# EAGLE design mini (EAGLE 9.6.2)
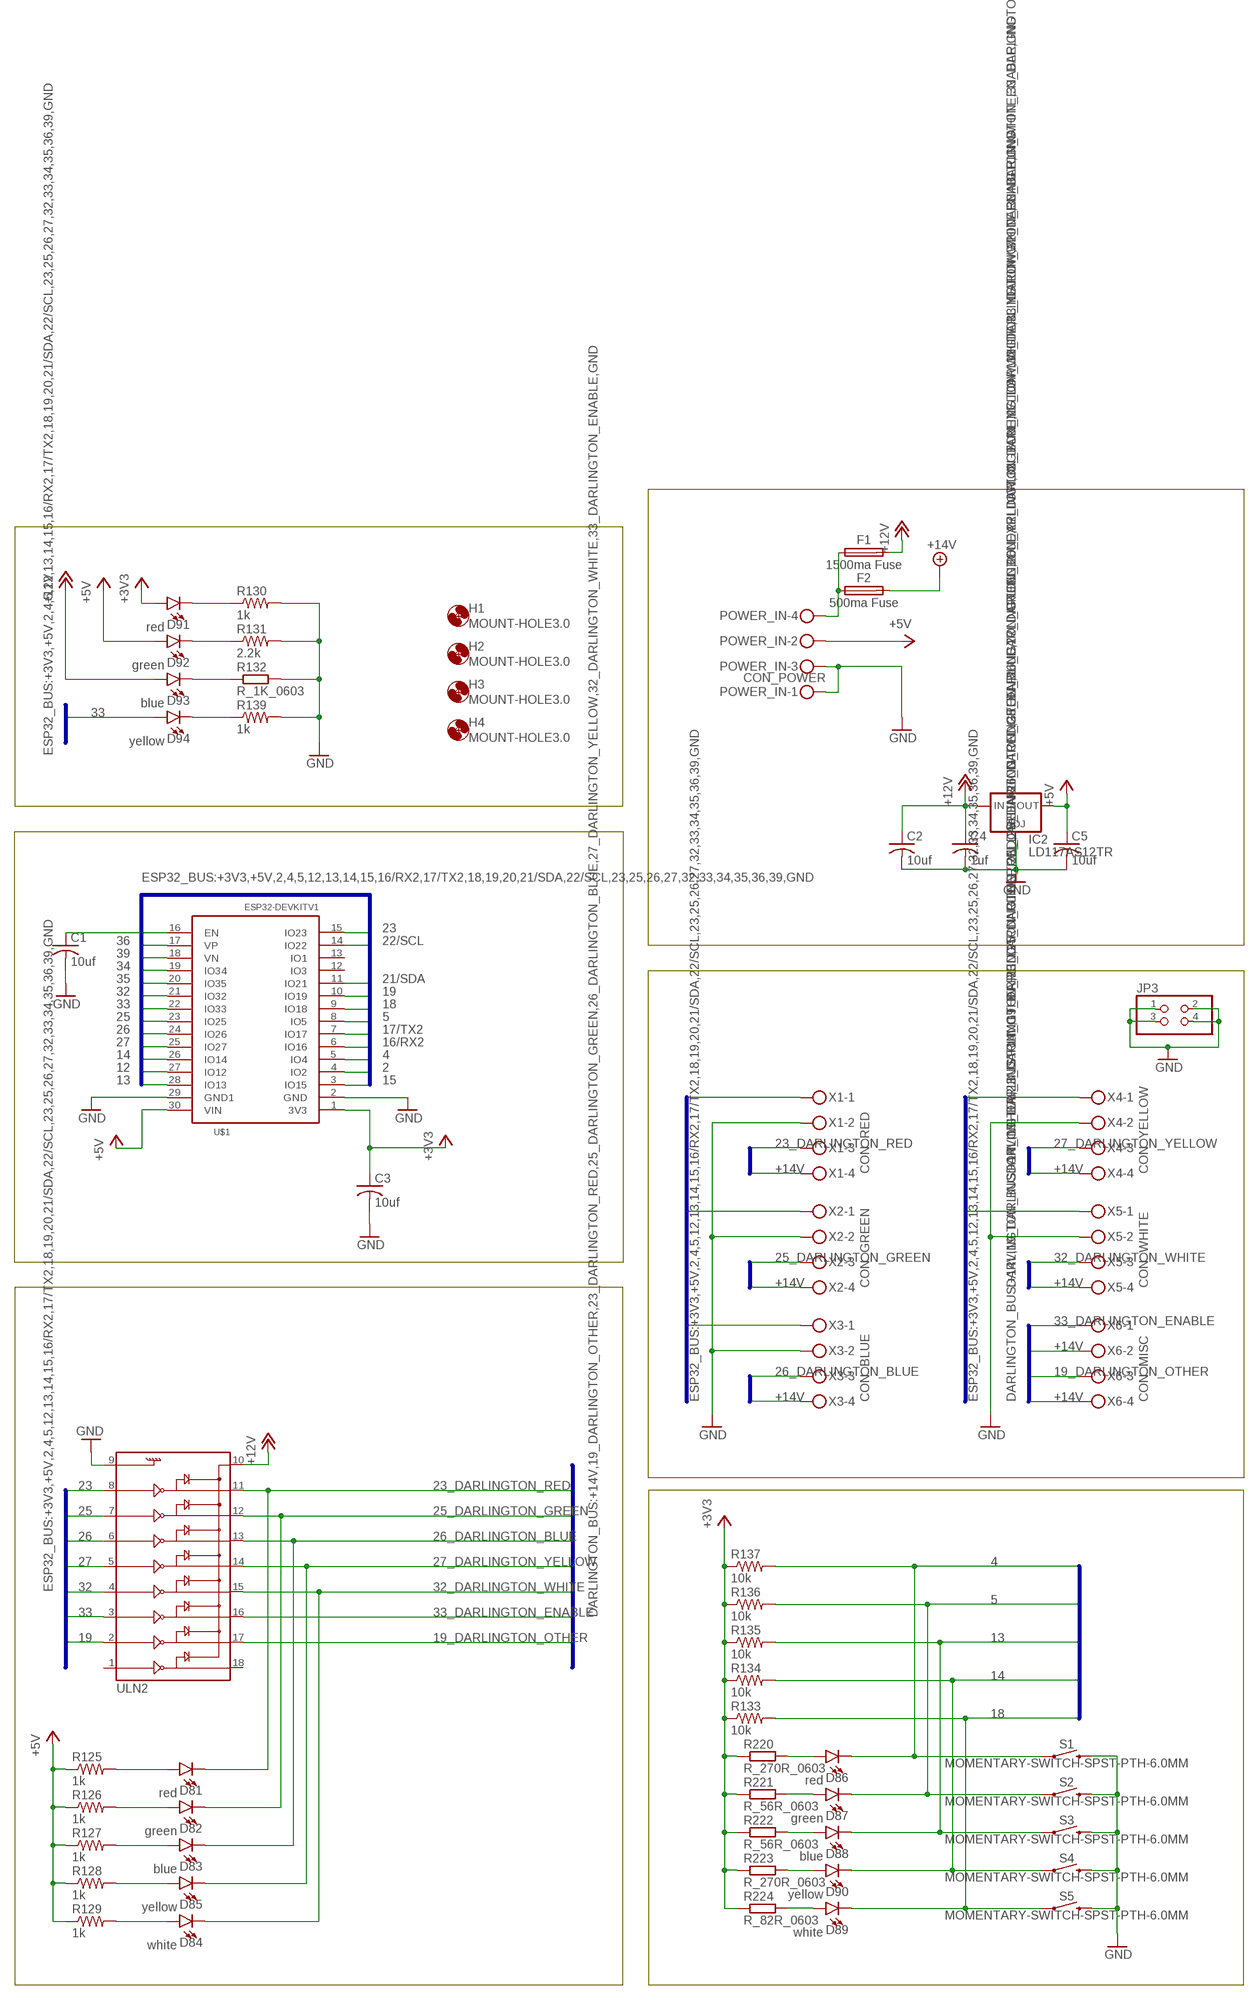
[diagram p0: schematic, sheet 1]

## Parts
C1  10uf  C-USC0603  [C0603]
C2  10uf  C-USC0603  [C0603]
C3  10uf  C-USC0603  [C0603]
C4  1uf  C-USC0805  [C0805]
C5  10uf  C-USC0603  [C0603]
D81  red  LED0603  [LED-0603]
D82  green  LED0603  [LED-0603]
D83  blue  LED0603  [LED-0603]
D84  white  LED0603  [LED-0603]
D85  yellow  LED0603  [LED-0603]
D86  red  LED0603  [LED-0603]
D87  green  LED0603  [LED-0603]
D88  blue  LED0603  [LED-0603]
D89  white  LED0603  [LED-0603]
D90  yellow  LED0603  [LED-0603]
D91  red  LED0603  [LED-0603]
D92  green  LED0603  [LED-0603]
D93  blue  LED0603  [LED-0603]
D94  yellow  LED0603  [LED-0603]
F1  1500ma Fuse  MF-MSMF-STYLE2_1  [FUSC4632X160]
F2  500ma Fuse  MF-MSMF-STYLE2_1  [FUSC4632X160]
H1  MOUNT-HOLE3.0  [3,0]
H2  MOUNT-HOLE3.0  [3,0]
H3  MOUNT-HOLE3.0  [3,0]
H4  MOUNT-HOLE3.0  [3,0]
IC2  LD117AS12TR  [SOT223]
JP3  PINHD-2X2  [2X02]
POWER_IN  CON_POWER  MKDSN1,5/4-5,08  [MKDSN1,5/4-5,08]
R125  1k  R-US_R0603  [R0603]
R126  1k  R-US_R0603  [R0603]
R127  1k  R-US_R0603  [R0603]
R128  1k  R-US_R0603  [R0603]
R129  1k  R-US_R0603  [R0603]
R130  1k  R-US_R0603  [R0603]
R131  2.2k  R-US_R0603  [R0603]
R132  R_1K_0603  [R0603]
R133  10k  R-US_R0603  [R0603]
R134  10k  R-US_R0603  [R0603]
R135  10k  R-US_R0603  [R0603]
R136  10k  R-US_R0603  [R0603]
R137  10k  R-US_R0603  [R0603]
R139  1k  R-US_R0603  [R0603]
R220  R_270R_0603  [R0603]
R221  R_56R_0603  [R0603]
R222  R_56R_0603  [R0603]
R223  R_270R_0603  [R0603]
R224  R_82R_0603  [R0603]
S1  MOMENTARY-SWITCH-SPST-PTH-6.0MM  [TACTILE_SWITCH_PTH_6.0MM]
S2  MOMENTARY-SWITCH-SPST-PTH-6.0MM  [TACTILE_SWITCH_PTH_6.0MM]
S3  MOMENTARY-SWITCH-SPST-PTH-6.0MM  [TACTILE_SWITCH_PTH_6.0MM]
S4  MOMENTARY-SWITCH-SPST-PTH-6.0MM  [TACTILE_SWITCH_PTH_6.0MM]
S5  MOMENTARY-SWITCH-SPST-PTH-6.0MM  [TACTILE_SWITCH_PTH_6.0MM]
U$1  ESP32DEVKITV1  [ESP32-DEVKITV1]
ULN2  ULN2803SOICW  [SO18L]
X1  CON_RED  MKDSN1,5/4-5,08  [MKDSN1,5/4-5,08]
X2  CON_GREEN  MKDSN1,5/4-5,08  [MKDSN1,5/4-5,08]
X3  CON_BLUE  MKDSN1,5/4-5,08  [MKDSN1,5/4-5,08]
X4  CON_YELLOW  MKDSN1,5/4-5,08  [MKDSN1,5/4-5,08]
X5  CON_WHITE  MKDSN1,5/4-5,08  [MKDSN1,5/4-5,08]
X6  CON_MISC  MKDSN1,5/4-5,08  [MKDSN1,5/4-5,08]

## Nets
2: U$1.4(IO2)
4: D86.C R137.2 S1.1 U$1.5(IO4) X1.1
5: D87.C R136.2 S2.1 U$1.8(IO5) X2.1
12: U$1.27(IO12)
13 [3V3]: D88.C R135.2 S3.1 U$1.28(IO13) X3.1
14: D90.C R134.2 S4.1 U$1.26(IO14) X4.1
15: U$1.3(IO15)
16/RX2: U$1.6(IO16)
17/TX2: U$1.7(IO17)
18: D89.C R133.2 S5.1 U$1.9(IO18) X5.1
19: U$1.10(IO19) ULN2.2
19_DARLINGTON_OTHER: ULN2.17 X6.3
21/SDA: U$1.11(IO21)
22/SCL: U$1.14(IO22)
23: U$1.15(IO23) ULN2.8
23_DARLINGTON_RED: D81.C ULN2.11 X1.3
25: U$1.23(IO25) ULN2.7
25_DARLINGTON_GREEN: D82.C ULN2.12 X2.3
26: U$1.24(IO26) ULN2.6
26_DARLINGTON_BLUE: D83.C ULN2.13 X3.3
27: U$1.25(IO27) ULN2.5
27_DARLINGTON_YELLOW: D85.C ULN2.14 X4.3
32: U$1.21(IO32) ULN2.4
32_DARLINGTON_WHITE: D84.C ULN2.15 X5.3
33: D94.A U$1.22(IO33) ULN2.3
33_DARLINGTON_ENABLE: ULN2.16 X6.1
34: U$1.19(IO34)
35: U$1.20(IO35)
36: U$1.17(VP)
39: U$1.18(VN)
+3V3 [3V3]: C3.1 D91.A R133.1 R134.1 R135.1 R136.1 R137.1 R220.1 R221.1 R222.1 R223.1 R224.1 U$1.1(3V3)
+5V [5V]: C5.1 D92.A IC2.4(OUT) POWER_IN.2 R125.1 R126.1 R127.1 R128.1 R129.1 U$1.30(VIN)
+12V [12V]: C2.1 C4.1 D93.A F1.2 IC2.3(IN) ULN2.10
+14V [12V]: F2.2 X1.4 X2.4 X3.4 X4.4 X5.4 X6.2 X6.4
GND [GND]: C1.2 C2.2 C3.2 C4.2 C5.2 IC2.1(ADJ) JP3.1 JP3.2 JP3.3 JP3.4 POWER_IN.1 POWER_IN.3 R130.2 R131.2 R132.2 R139.2 S1.3 S2.3 S3.3 S4.3 S5.3 U$1.2(GND) U$1.29(GND1) ULN2.9 X1.2 X2.2 X3.2 X4.2 X5.2
N$1: C1.1 U$1.16(EN)
N$151: D84.A R129.2
N$152: D85.A R128.2
N$153: D83.A R127.2
N$154: D82.A R126.2
N$155: D81.A R125.2
N$156: D91.C R130.1
N$157: D92.C R131.1
N$158: D93.C R132.1
N$159: D94.C R139.1
N$320: D86.A R220.2
N$321: D87.A R221.2
N$322: D88.A R222.2
N$323: D90.A R223.2
N$324: D89.A R224.2
N$346 [12V]: F1.1 F2.1 POWER_IN.4
Unconnected: U$1.12(IO3) U$1.13(IO1) ULN2.1 ULN2.18

## Buses
ESP32_BUS:+3V3,+5V,2,4,5,12,13,14,15,16/RX2,17/TX2,18,19,20,21/SDA,22/SCL,23,25,26,27,32,33,34,35,36,39,GND
DARLINGTON_BUS:+14V,19_DARLINGTON_OTHER,23_DARLINGTON_RED,25_DARLINGTON_GREEN,26_DARLINGTON_BLUE,27_DARLINGTON_YELLOW,32_DARLINGTON_WHITE,33_DARLINGTON_ENABLE,GND

## Library data of the parts
C1-C3 C5 = rcl:C-US: CAPACITOR, American symbol; LCSC_PART: C19702; SPICEPREFIX: C
C4 = rcl:C-US: CAPACITOR, American symbol; LCSC_PART: C15849; SPICEPREFIX: C
D81 D86 D91 = SparkFun-LED:LED: LED (Generic) Standard schematic elements and footprints for 5mm, 3mm, 1206, and 0603 sized LEDs. Generic LEDs with no color specified.; LCSC_PART: C2286
D82 D87 D92 = SparkFun-LED:LED: LED (Generic) Standard schematic elements and footprints for 5mm, 3mm, 1206, and 0603 sized LEDs. Generic LEDs with no color specified.; LCSC_PART: C72043
D83 D88 D93 = SparkFun-LED:LED: LED (Generic) Standard schematic elements and footprints for 5mm, 3mm, 1206, and 0603 sized LEDs. Generic LEDs with no color specified.; LCSC_PART: C72041
D84 D89 = SparkFun-LED:LED: LED (Generic) Standard schematic elements and footprints for 5mm, 3mm, 1206, and 0603 sized LEDs. Generic LEDs with no color specified.; LCSC_PART: C2290
D85 D90 D94 = SparkFun-LED:LED: LED (Generic) Standard schematic elements and footprints for 5mm, 3mm, 1206, and 0603 sized LEDs. Generic LEDs with no color specified.; LCSC_PART: C72038
F1 = Fuse:MF-MSMF: PTC Resettable Fuses Datasheet <https://www.bourns.com/docs/Product-Datasheets/mfmsmf.pdf?sfvrsn=26>; CATEGORY: FUSE; DESCRIPTION: PTC Resettable Fuses; LCSC_PART: C78695; MANUFACTURER: BOURNS; MPN: MF-MSMF; OPERATING_TEMPERATURE: -40 °C to +85 °C; PART_STATUS: Active; ROHS_COMPLIANCE: RoHS Compliant; SERIES: MF-MSMF; SUB-CATEGORY: Resettable; TYPE: PTC
F2 = Fuse:MF-MSMF: PTC Resettable Fuses Datasheet <https://www.bourns.com/docs/Product-Datasheets/mfmsmf.pdf?sfvrsn=26>; CATEGORY: FUSE; DESCRIPTION: PTC Resettable Fuses; LCSC_PART: C70113; MANUFACTURER: BOURNS; MPN: MF-MSMF; OPERATING_TEMPERATURE: -40 °C to +85 °C; PART_STATUS: Active; ROHS_COMPLIANCE: RoHS Compliant; SERIES: MF-MSMF; SUB-CATEGORY: Resettable; TYPE: PTC
H1-H4 = holes:MOUNT-HOLE: MOUNTING HOLE with drill center marker
IC2 = v-reg:LD117A?*: Low drop fixed and adjustable positive voltage regulators 1 A Source: http://www.st.com/stonline/products/literature/ds/7194/ld1117axx.pdf; LCSC_PART: C6187; PRICE: 0.5
JP3 = pinhead:PINHD-2X2: PIN HEADER
POWER_IN X1-X6 = con-phoenix-508-jm:MKDSN1,5/4-5,08: MKDSN 1,5/ 4-5,08 Printklemme Nennstrom: 13,5 A Nennspannung: 250 V Rastermaß: 5,08 mm Polzahl: 4 Anschlussart: Schraubanschluss Montage: Löten Anschlussrichtung Leiter/Platine: 0 ° Artikelnummer: 1729144 Source: http://eshop.phoenixcontact.com .. 1729144.pdf
R125-R130 R139 = rcl:R-US_: RESISTOR, American symbol; LCSC_PART: C21190; SPICEPREFIX: R
R131 = rcl:R-US_: RESISTOR, American symbol; LCSC_PART: C4190; SPICEPREFIX: R
R132 = JLC PCB Basic Parts_loc:R_: Resistor General purpose SMD Resistor; LCSC_DATASHEET: https://datasheet.lcsc.com/lcsc/2110252030_UNI-ROYAL-Uniroyal-Elec-0603WAF1001T5E_C21190.pdf; LCSC_PART: C21190; LCSC_ROTATION_CCW: 0; LCSC_STOCK: 5175299; PROPERTIES: ±1% 1/10W Thick Film Resistors 75V ±100ppm -55°C~+155°C 1kOhm 0603 ROHS
R133-R137 = rcl:R-US_: RESISTOR, American symbol; LCSC_PART: C25804; SPICEPREFIX: R
R220 R223 = JLC PCB Basic Parts_loc:R_: Resistor General purpose SMD Resistor; LCSC_DATASHEET: https://datasheet.lcsc.com/lcsc/2110252130_UNI-ROYAL-Uniroyal-Elec-0603WAF2700T5E_C22966.pdf; LCSC_PART: C22966; LCSC_ROTATION_CCW: 0; LCSC_STOCK: 315292; PROPERTIES: ±1% 1/10W Thick Film Resistors 75V ±100ppm -55°C~+155°C 270Ohm 0603 ROHS
R221 R222 = JLC PCB Basic Parts_loc:R_: Resistor General purpose SMD Resistor; LCSC_DATASHEET: https://datasheet.lcsc.com/lcsc/2110252230_UNI-ROYAL-Uniroyal-Elec-0603WAF560JT5E_C25196.pdf; LCSC_PART: C25196; LCSC_ROTATION_CCW: 0; LCSC_STOCK: 82739; PROPERTIES: ±1% 1/10W Thick Film Resistors 75V ±200ppm -55°C~+155°C 56Ohm 0603 ROHS
R224 = JLC PCB Basic Parts_loc:R_: Resistor General purpose SMD Resistor; LCSC_DATASHEET: https://datasheet.lcsc.com/lcsc/2110252230_UNI-ROYAL-Uniroyal-Elec-0603WAF820JT5E_C23255.pdf; LCSC_PART: C23255; LCSC_ROTATION_CCW: 0; LCSC_STOCK: 149533; PROPERTIES: ±1% 1/10W Thick Film Resistors 75V ±100ppm -55°C~+155°C 82Ohm 0603 ROHS
S1-S5 = SparkFun-Switches:MOMENTARY-SWITCH-SPST: Momentary Switch (Pushbutton) - SPST Normally-open (NO) SPST momentary switches (buttons, pushbuttons). Variants PTH-12MM - 12mm square, through-hole Momentary Pushbutton Switch - 12mm Square <https://www.sparkfun.com/products/9190> (COM-09190) PTH-6.0MM, PTH-6.0MM-KIT - 6.0mm square, through-hole Mini Pushbutton Switch <https://www.sparkfun.com/products/97> (COM-00097) KIT package intended for soldering kit's - only one side of pads' copper is exposed. PTH-RIGHT-ANGLE-KIT - Right-angle, through-hole Right Angle Tactile Button <https://www.sparkfun.com/products/10791> - Used on SparkFun BigTime Watch Kit <https://www.sparkfun.com/products/11734> SMD-12MM - 12mm square, surface-mount Tactile Button - SMD (12mm) <https://www.sparkfun.com/products/12993> (COM-12993) Used on SparkFun PicoBoard <https://www.sparkfun.com/products/11888> SMD-4.5MM - 4.5mm Square Trackball Switch Used on SparkFun Blackberry Trackballer Breakout <https://www.sparkfun.com/products/13169> SMD-4.6MMX2.8MM - 4.60mm x 2.80mm, surface mount Used on SparkFun SAMD21 Mini Breakout <https://www.sparkfun.com/products/13664> SMD-5.2MM, SMD-5.2-REDUNDANT - 5.2mm square, surface-mount Mini Pushbutton Switch - SMD <https://www.sparkfun.com/products/8720> (COM-08720) Used on Arduino Pro Mini <https://www.sparkfun.com/products/11114> REDUNDANT package connects both switch circuits together SMD-6.0X3.5MM - 6.0 x 3.5mm, surface mount Momentary Reset Switch SMD <https://www.sparkfun.com/products/8229> (COM-08229) SMD-6.2MM-TALL - 6.2mm square, surface mount Tactile Button - SMD (6mm) <https://www.sparkfun.com/products/12992> Used on SparkFun Digital Sandbox <https://www.sparkfun.com/products/12651> SMD-RIGHT-ANGLE - Right-angle, surface mount Used on SparkFun Block for Intel® Edison - Arduino <https://www.sparkfun.com/products/13036>; PROD_ID: SWCH-08441; SF_SKU: COM-00097
U$1 = ESP32-DEVKITV1:ESP32DEVKITV1
ULN2 = SparkFun-IC-Special-Function:ULN2803: Darlington Driver(IC-07959, low stock) ULN2803 Darlington array. 500mA max per channel, 8-channel package. Spark Fun Electronics SKU : COM-00312

## Net classes
0 default: width 0.305 mm, clearance 0.305 mm
1 GND: width 0.508 mm, clearance 0.305 mm
2 12V: width 1.27 mm, clearance 0.305 mm
3 5V: width 0.508 mm, clearance 0.305 mm
4 3V3: width 0.508 mm, clearance 0.305 mm

## Board
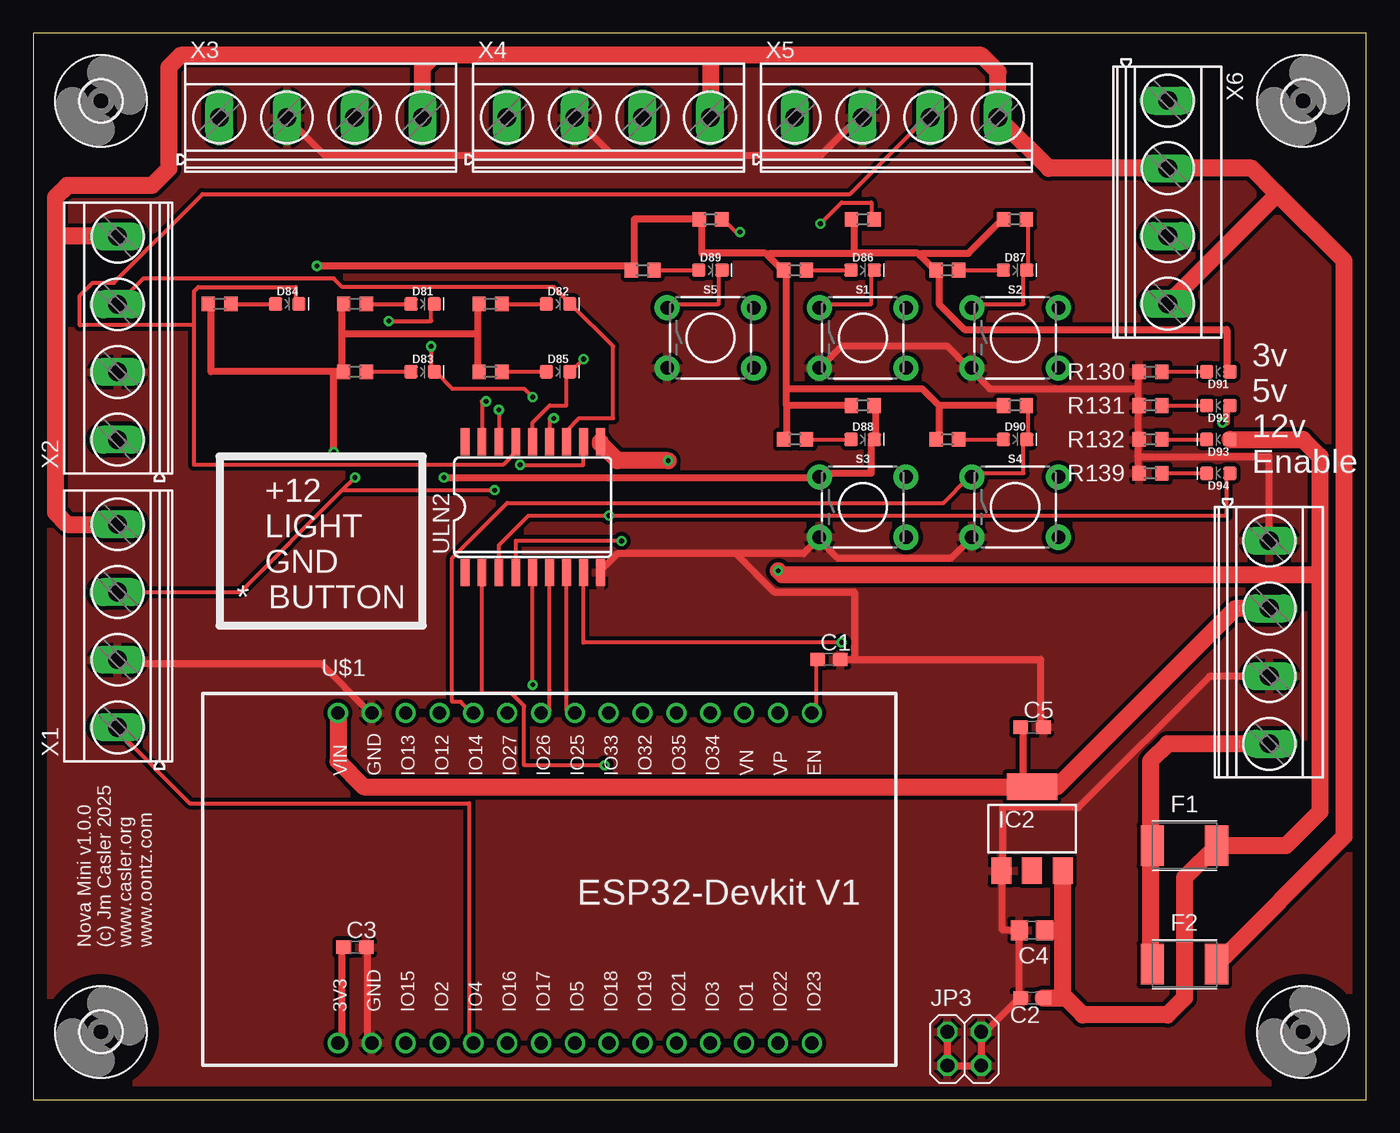
[diagram p1: board, top side]
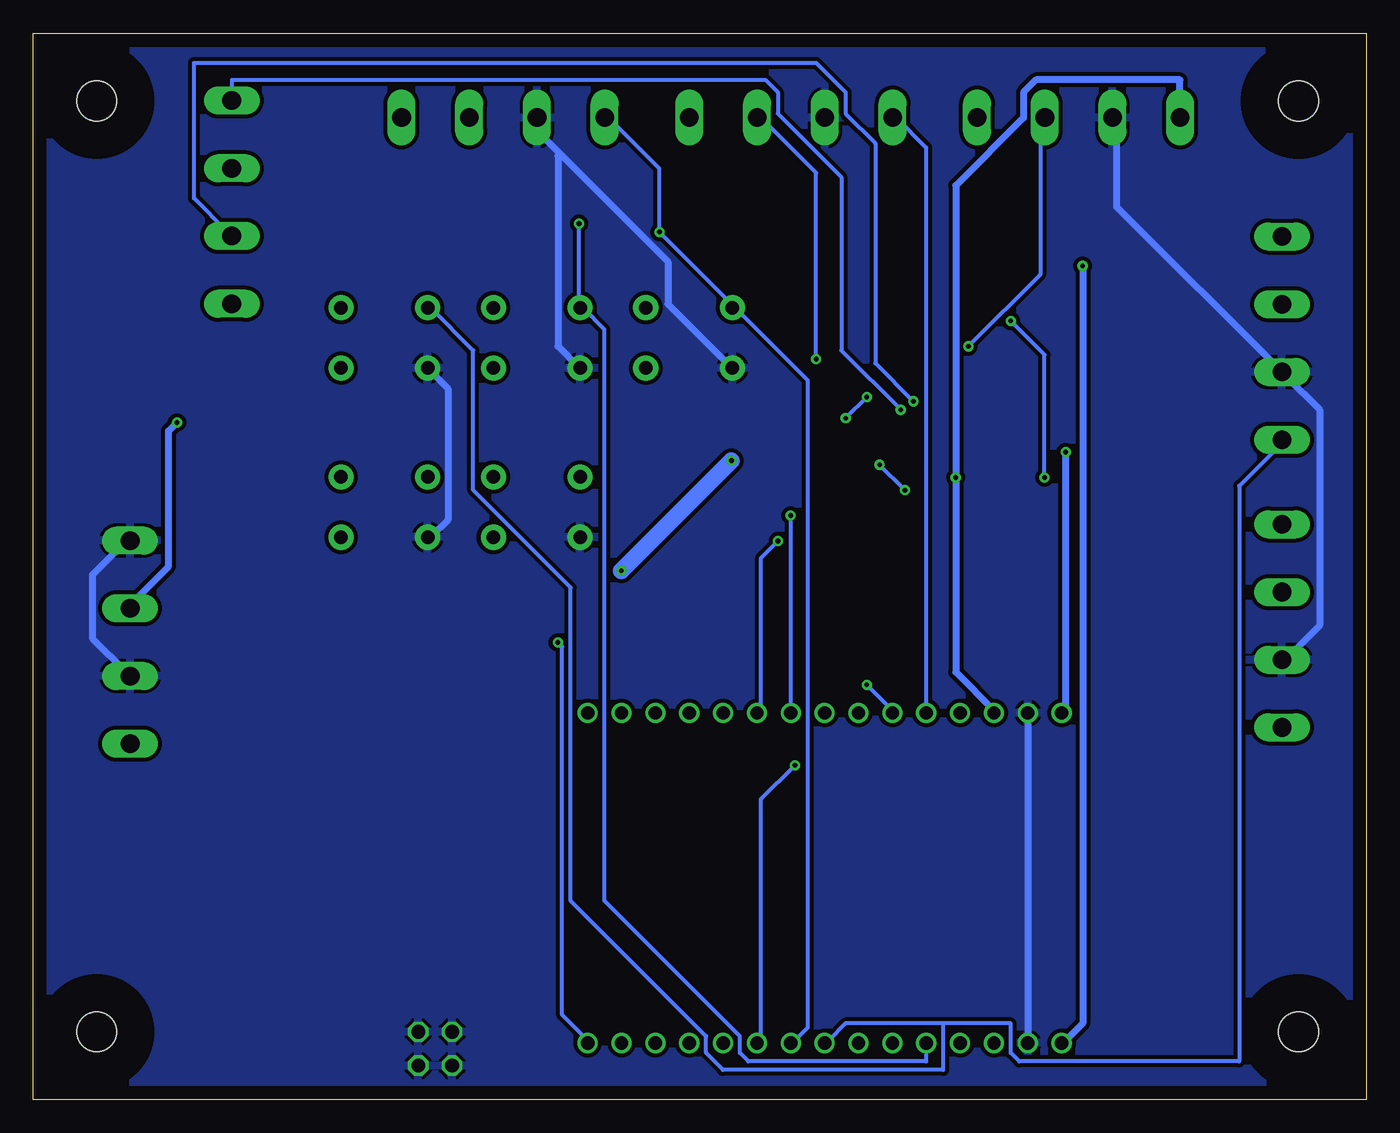
[diagram p2: board, bottom side, seen from below]

Size 100 x 80 mm. Coordinates in mm from the lower left corner, seen from the top.
Outline: 0,0 100,0 100,80 0,80 0,0
Copper layers (1*16): Top 0.035mm / dielectric 1.5mm / Bottom 0.035mm
Design rules "default": minimum track width 6mil, minimum drill 0.35mm, track to track 6mil, track to pad 6mil, pad to pad 6mil, via to via 6mil, smd to smd 6mil, copper to edge 40mil, drill to drill 6mil, minimum pad ring 10mil, minimum via ring 8mil, stop-mask expansion 4mil, vias tented up to drill 0mil, thermal gap 10mil

### Footprints (pad centres in the part's own frame; a part is rotated, then mirrored left to right if it is on the bottom)
C0603 = smd 1.1 x 1: 1 -0.85,0; 2 0.85,0
C0805 = smd 1.3 x 1.5: 1 -0.95,0; 2 0.95,0
LED-0603 = smd 1 x 1: A -0.877,0; C 0.877,0
FUSC4632X160 = smd 1.73 x 3.05: 1 -2.415,0; 2 2.415,0
3,0 = hole 3: 0,0
SOT223 = smd 1.5 x 2: 1 -2.3,-3.15; 2 0,-3.15; 3 2.3,-3.15 | smd 3.8 x 2: 4 0,3.15
2X02 = drill 1.016 octagon: 1 -1.27,-1.27; 2 -1.27,1.27; 3 1.27,-1.27; 4 1.27,1.27
MKDSN1,5/4-5,08 = drill 1.397 pad 2 long: 1 -7.641,0.025; 2 -2.561,0.025; 3 2.519,0.025; 4 7.599,0.025
R0603 = smd 1 x 1.1: 1 -0.85,0; 2 0.85,0
TACTILE_SWITCH_PTH_6.0MM = drill 1.016 pad 1.88: 1 -3.251,2.261; 2 3.251,2.261; 3 -3.251,-2.261; 4 3.251,-2.261
ESP32-DEVKITV1 = drill 1 pad 1.422: 1 -22.87,-13.54; 2 -20.33,-13.54; 3 -17.79,-13.54; 4 -15.25,-13.54; 5 -12.71,-13.54; 6 -10.17,-13.54; 7 -7.63,-13.54; 8 -5.09,-13.54; 9 -2.55,-13.54; 10 -0.01,-13.54; 11 2.53,-13.54; 12 5.07,-13.54; 13 7.61,-13.54; 14 10.15,-13.54; 15 12.69,-13.54; 16 12.69,11.23; 17 10.15,11.23; 18 7.61,11.23; 19 5.07,11.23; 20 2.53,11.23; 21 -0.01,11.23; 22 -2.55,11.23; 23 -5.09,11.23; 24 -7.63,11.23; 25 -10.17,11.23; 26 -12.71,11.23; 27 -15.25,11.23; 28 -17.79,11.23; 29 -20.33,11.23; 30 -22.87,11.23
SO18L = smd 0.66 x 2.032: 1 -0.635,-4.902; 2 0.635,-4.902; 3 1.905,-4.902; 4 3.175,-4.902; 5 4.445,-4.902; 6 5.715,-4.902; 7 6.985,-4.902; 8 8.255,-4.902; 9 9.525,-4.902; 10 9.525,4.902; 11 8.255,4.902; 12 6.985,4.902; 13 5.715,4.902; 14 4.445,4.902; 15 3.175,4.902; 16 1.905,4.902; 17 0.635,4.902; 18 -0.635,4.902

### Placement (x,y rotation side)
C1  59.69,33.02 0 top
C2  74.93,7.62 180 top
C3  24.13,11.43 0 top
C4  74.93,12.7 180 top
C5  74.93,27.94 0 top
D81  29.21,59.69 0 top
D82  39.37,59.69 0 top
D83  29.21,54.61 0 top
D84  19.05,59.69 0 top
D85  39.37,54.61 0 top
D86  62.23,62.23 0 top
D87  73.66,62.23 0 top
D88  62.23,49.53 0 top
D89  50.8,62.23 0 top
D90  73.66,49.53 0 top
D91  88.9,54.61 180 top
D92  88.9,52.07 180 top
D93  88.9,49.53 180 top
D94  88.9,46.99 180 top
F1  86.36,19.05 0 top
F2  86.36,10.16 0 top
H1  95.25,74.93 0 top
H2  95.25,5.08 0 top
H3  5.08,5.08 0 top
H4  5.08,74.93 0 top
IC2  74.93,20.32 0 top
JP3  69.85,3.81 0 top
POWER_IN  92.71,34.29 270 top
R125  24.13,59.69 0 top
R126  34.29,59.69 0 top
R127  24.13,54.61 0 top
R128  34.29,54.61 0 top
R129  13.97,59.69 0 top
R130  83.82,54.61 180 top
R131  83.82,52.07 180 top
R132  83.82,49.53 180 top
R133  50.8,66.04 0 top
R134  73.66,52.07 0 top
R135  62.23,52.07 0 top
R136  73.66,66.04 0 top
R137  62.23,66.04 0 top
R139  83.82,46.99 180 top
R220  57.15,62.23 0 top
R221  68.58,62.23 0 top
R222  57.15,49.53 0 top
R223  68.58,49.53 0 top
R224  45.72,62.23 0 top
S1  62.23,57.15 0 top
S2  73.66,57.15 0 top
S3  62.23,44.45 0 top
S4  73.66,44.45 0 top
S5  50.8,57.15 0 top
U$1  45.72,17.78 0 top
ULN2  33.02,44.45 0 top
X1  6.35,35.56 90 top
X2  6.35,57.15 90 top
X3  21.59,73.66 0 top
X4  43.18,73.66 0 top
X5  64.77,73.66 0 top
X6  85.09,67.31 270 top

### Tracks (layer width: path | path; a pad name or v marks a point on that pad's centre or on a via)
4  (via drill 0.35)
  Top 0.305: D86.C 62.87,62.23 62.87,59.69 59.05,59.69 S1.1 | v59.05,65.72 60.64,67.31 62.87,67.31 62.87,66.04 R137.2 | U$1.5 32.7,4.45 32.7,22.23 11.75,22.23 6.35,27.62 X1.1
  Bottom 0.305: v59.05,65.72 59.05,59.69 S1.1 58.74,59.37 57.15,57.78 57.15,14.92 46.99,4.76 46.99,3.49 46.35,2.86 33.02,2.86 33.02,4.13 U$1.5
5
  Top 0.305: R136.2 74.61,66.04 74.61,62.23 D87.C 74.3,62.23 74.3,59.69 70.48,59.69 S2.1
  Bottom 0.305: 31.75,5.71 26.67,5.71 26.67,3.49 26.04,2.86 9.53,2.86 9.53,46.04 6.35,49.21 X2.1 | 31.75,5.71 39.05,5.71 40.32,4.45 U$1.8 | 31.75,5.71 31.75,2.22 48.26,2.22 49.53,3.49 49.53,4.76 59.69,14.92 59.69,38.42 66.99,45.72 66.99,56.2 70.17,59.37 S2.1
13  (via drill 0.35)
  Top 0.508: R135.2 63.18,52.07 63.18,49.53 D88.C 62.87,49.53 62.87,46.99 59.05,46.99 S3.1 58.74,46.67 v30.8,46.67
  Bottom 0.508: U$1.28 27.94,29.21 30.8,32.07 v30.8,46.67 30.8,68.58 25.72,73.66 25.72,75.56 24.77,76.52 13.97,76.52 13.97,73.98 X3.1
14
  Top 0.305: R134.2 74.61,52.07 74.61,49.53 D90.C 74.3,49.53 74.3,46.99 70.48,46.99 S4.1 70.17,46.67 68.26,44.77 35.56,44.77 31.43,40.64 31.43,29.84 32.07,29.84 32.7,29.21 U$1.26
  Bottom 0.305: U$1.26 33.02,29.21 33.02,71.44 35.24,73.66 X4.1
18  (via drill 0.35)
  Top 0.305: D89.C 51.44,62.23 51.44,59.69 47.62,59.69 S5.1 | v53.02,65.09 52.7,65.09 51.75,66.04 R133.2
  Bottom 0.305: U$1.9 42.86,4.45 41.91,5.4 41.91,53.98 47.31,59.37 S5.1 47.62,59.69 v53.02,65.09 53.02,69.85 56.83,73.66 X5.1
19  (via drill 0.35)
  Top 0.305: ULN2.2 33.66,30.48 35.88,30.48 36.83,29.53 36.83,25.08 v42.86,25.08
  Bottom 0.305: v42.86,25.08 45.4,22.54 45.4,4.45 U$1.10
19_DARLINGTON_OTHER  (via drill 0.35)
  Top 0.305: ULN2.17 33.66,52.39 v33.97,52.39
  Bottom 0.305: v33.97,52.39 36.83,55.24 36.83,71.75 39.05,73.98 39.05,75.56 41.27,77.79 87.95,77.79 87.95,67.63 85.41,65.09 X6.3
23  (via drill 0.35)
  Top 0.305: ULN2.8 41.27,34.29 v60.64,34.29
  Bottom 0.305: v60.64,34.29 60.33,33.97 60.33,6.35 58.42,4.45 U$1.15
23_DARLINGTON_RED  (via drill 0.35)
  Top 0.305: v26.67,58.42 29.84,58.42 29.84,59.69 D81.C | 23.18,45.72 15.56,38.1 6.35,38.1 X1.3 | 23.18,45.72 v24.13,46.67 | ULN2.11 41.27,47.62 v36.51,47.62 | 23.18,45.72 v34.61,45.72
  Bottom 0.305: v26.67,58.42 24.13,55.88 v24.13,46.67 | v34.61,45.72 v36.51,47.62
25
  Top 0.305: ULN2.7 40.01,29.21 40.32,29.21 U$1.23
25_DARLINGTON_GREEN
  Top 0.305: 40.32,59.69 43.5,56.52 43.5,51.12 40.96,51.12 40.01,50.16 ULN2.12 | 40.32,59.69 39.05,60.96 23.18,60.96 22.54,61.59 8.26,61.59 6.35,59.69 X2.3 | 40.32,59.69 D82.C
26
  Top 0.305: ULN2.6 38.73,29.21 38.1,29.21 U$1.24
26_DARLINGTON_BLUE  (via drill 0.35)
  Top 0.305: v29.84,56.52 29.84,54.61 D83.C 30.16,54.61 31.43,53.34 36.83,53.34 v37.47,52.7 | ULN2.13 38.73,51.12 v39.05,51.12
  Bottom 0.305: v29.84,56.52 24.45,61.91 24.45,73.34 24.13,73.66 X3.3 | v37.47,52.7 v39.05,51.12
27  (via drill 0.35)
  Top 0.305: v37.47,31.11 ULN2.5
  Bottom 0.305: v37.47,31.11 35.56,29.21 U$1.25
27_DARLINGTON_YELLOW  (via drill 0.35)
  Top 0.305: ULN2.14 37.47,50.8 38.73,52.07 40.01,52.07 40.01,54.61 D85.C 40.32,54.61 v41.27,55.56
  Bottom 0.305: v41.27,55.56 41.27,69.53 45.4,73.66 X4.3
32  (via drill 0.35)
  Top 0.305: ULN2.4 36.2,41.91 v44.13,41.91
  Bottom 0.305: v44.13,41.91 45.4,40.64 45.4,29.21 U$1.21
32_DARLINGTON_WHITE
  Top 0.305: 12.06,58.1 12.06,47.62 35.24,47.62 36.2,48.58 ULN2.15 | 12.06,58.1 12.06,60.64 12.38,60.96 19.68,60.96 19.68,59.69 D84.C | 12.06,58.1 3.49,58.1 3.49,60.33 4.45,61.28 6.03,61.28 12.7,67.94 61.28,67.94 66.99,73.66 X5.3
33  (via drill 0.35)
  Top 0.305: ULN2.3 34.92,41.59 37.15,43.81 v43.18,43.81 89.53,43.81 89.53,46.99 D94.A
  Bottom 0.305: v43.18,43.81 43.18,29.21 U$1.22
33_DARLINGTON_ENABLE  (via drill 0.35)
  Top 0.305: v34.92,51.75 ULN2.16
  Bottom 0.305: v34.92,51.75 39.37,56.2 39.37,69.22 44.13,73.98 44.13,75.56 45.09,76.52 85.09,76.52 85.09,75.25 X6.1
+3V3  (via drill 0.35)
  Top 0.508: D91.A 89.53,54.61 89.53,57.78 69.85,57.78 67.94,59.69 67.94,62.23 R221.1 67.63,62.23 66.52,63.34 | 61.59,63.5 61.59,66.04 R137.1 | 61.59,63.5 66.36,63.5 66.52,63.34 | R136.1 72.71,66.04 70.17,63.5 66.67,63.5 66.52,63.34 | C3.1 23.18,11.43 23.18,4.45 22.86,4.45 U$1.1 | 45.09,62.55 45.09,66.04 R133.1 50.16,66.04 50.16,63.5 54.93,63.5 55.09,63.34 | 45.09,62.55 45.09,62.23 R224.1 45.09,62.55 | 67.94,52.07 67.94,49.53 R223.1 | R134.1 67.94,52.07 | 56.52,52.07 56.52,49.53 R222.1 | R135.1 56.52,52.07 | 56.52,52.07 56.52,53.34 | 56.52,53.34 56.52,62.23 R220.1 56.2,62.23 55.09,63.34 | 67.94,52.07 66.67,53.34 56.52,53.34 | 45.09,62.55 v21.27,62.55 | 61.59,63.5 55.24,63.5 55.09,63.34
  Bottom 0.508: v21.27,62.55 21.27,5.71 22.54,4.45 U$1.1
+5V  (via drill 0.35)
  Top 0.508: 33.34,57.47 33.34,59.69 R126.1 | 33.34,57.47 33.34,54.61 R128.1 | 23.18,54.61 22.54,54.61 | 22.54,54.61 13.34,54.61 13.34,59.69 R129.1 | 23.18,54.61 23.18,57.47 | 23.18,57.47 23.18,59.69 R125.1 | 23.18,54.61 R127.1 | 23.18,57.47 33.34,57.47 | v89.22,50.8 89.53,50.8 89.53,52.07 D92.A | C5.1 74.3,27.94 74.3,23.81 IC2.4 | v22.54,48.58 22.54,54.61
  Top 1.27: POWER_IN.2 92.71,36.83 90.17,36.83 76.81,23.47 IC2.4 24.79,23.47 22.86,25.4 U$1.30
  Bottom 0.508: v89.22,50.8 89.85,50.16 89.85,40.01 92.71,37.15 POWER_IN.2 | v22.54,48.58 22.54,29.21 U$1.30
+12V  (via drill 0.35)
  Top 1.27: 77.23,12.7 77.23,7.86 77.47,7.62 | 77.23,12.7 IC2.3 | 77.47,7.62 78.74,6.35 85.09,6.35 86.36,7.62 86.36,16.64 F1.2 93.98,19.05 96.52,21.59 96.52,39.37 | C4.1 77.23,12.7 | C2.1 77.47,7.62 | D93.A 95.25,49.53 96.52,48.26 96.52,39.37 | v47.62,47.94 43.81,47.94 42.55,49.21 ULN2.10 | v55.88,39.69 56.2,39.37 96.52,39.37
  Bottom 1.27: v55.88,39.69 v47.62,47.94
+14V
  Top 1.27: F2.2 98.35,19.73 98.35,62.94 93.34,67.94 | 93.34,67.94 91.42,69.87 X6.2 76.18,69.87 X5.4 72.37,77.1 71.12,78.35 50.8,78.35 | X3.4 29.19,77.45 30.09,78.35 | 50.8,78.35 30.09,78.35 | X1.4 2.56,43.16 1.65,44.07 1.65,64.77 | 30.09,78.35 11.04,78.35 10.16,77.47 10.16,69.85 8.89,68.58 2.54,68.58 1.65,67.69 1.65,64.77 | X2.4 6.3,64.77 1.65,64.77 | 50.8,78.35 50.8,73.98 X4.4 | 93.34,67.94 85.41,60.01 X6.4
GND
  Top 0.508: C1.2 61.59,33.02 | 61.59,33.02 75.56,33.02 75.56,27.94 C5.2 | 52.7,40.96 57.78,40.96 58.74,41.91 S3.3 59.05,41.91 60.33,40.64 68.9,40.64 70.17,41.91 S4.3 | 52.7,40.96 43.81,40.96 42.55,39.69 ULN2.9 | 61.59,33.02 61.59,38.1 55.56,38.1 52.7,40.96 | JP3.2 JP3.1 JP3.3 JP3.4 71.44,5.08 73.98,7.62 | 73.98,7.62 C4.2 | 73.98,7.62 C2.2 | C4.2 72.71,12.7 72.71,17.14 IC2.1 72.71,17.46 72.71,21.91 78.42,21.91 88.27,31.75 92.71,31.75 POWER_IN.3 | C4.2 | 82.87,49.53 82.87,48.26 | 82.87,48.26 82.87,46.99 R139.2 | 82.87,53.34 82.87,54.61 R130.2 | 82.87,53.34 82.87,52.07 | 82.87,52.07 82.87,49.53 | 82.87,49.53 R132.2 | 82.87,52.07 R131.2 | 82.87,53.34 71.75,53.34 70.48,54.61 S2.3 70.17,54.93 68.58,56.52 60.64,56.52 59.05,54.93 S1.3 | 82.87,48.26 92.71,48.26 92.71,42.23 POWER_IN.1 | C3.2 25.08,11.43 25.08,4.45 U$1.2 | U$1.29 25.08,29.21 21.59,32.7 6.35,32.7 X1.2 | 43.34,70.96 43.5,70.8 59.05,70.8 61.91,73.66 X5.2 | 43.34,70.96 40.64,73.66 X4.2 | X3.2 19.05,73.66 21.91,70.8 43.18,70.8 43.34,70.96
  Bottom 0.508: POWER_IN.3 93.03,32.07 95.57,34.61 95.57,39.37 93.03,41.91 POWER_IN.1 | S4.3 70.17,42.23 68.9,43.5 68.9,53.34 70.17,54.61 S2.3 | U$1.2 25.4,4.45 25.4,28.89 U$1.29 | X3.2 18.73,73.66 18.73,66.99 6.35,54.61 X2.2 6.03,54.29 3.49,51.75 3.49,35.56 6.03,33.02 X1.2 | 60.48,70.96 61.91,72.39 61.91,73.66 X5.2 | 60.48,70.96 52.39,62.87 52.39,59.69 47.62,54.93 S5.3 | S1.3 59.05,54.93 60.64,56.52 60.64,70.8 60.48,70.96
  pour Top (isolate 0.254): -1.27,81.28 101.6,81.28 101.6,-1.27 -1.27,-1.27
  pour Bottom (isolate 0.254): -2.54,82.55 102.87,82.55 102.87,-2.54 -2.54,-2.54
N$1
  Top 0.305: C1.1 58.74,33.02 58.74,29.21 58.42,29.21 U$1.16
N$151
  Top 0.305: R129.2 D84.A
N$152
  Top 0.305: R128.2 D85.A
N$153
  Top 0.305: R127.2 D83.A
N$154
  Top 0.305: R126.2 D82.A
N$155
  Top 0.305: R125.2 D81.A
N$156
  Top 0.305: R130.1 D91.C
N$157
  Top 0.305: R131.1 D92.C
N$158
  Top 0.305: R132.1 D93.C
N$159
  Top 0.305: R139.1 D94.C
N$320
  Top 0.305: R220.2 D86.A
N$321
  Top 0.305: R221.2 D87.A
N$322
  Top 0.305: R222.2 D88.A
N$323
  Top 0.305: R223.2 D90.A
N$324
  Top 0.305: R224.2 D89.A
N$346
  Top 1.27: POWER_IN.4 85.11,26.69 83.82,25.4 83.82,19.05 | 83.82,19.05 83.82,10.29 F2.1 | 84.14,19.05 F1.1 83.82,19.05

### Text on the board
tPlace: 3v / 5v / 12v / Enable | +12 / LIGHT / GND / * BUTTON | Nova Mini v1.0.0 / (c) Jm Casler 2025 / www.casler.org / www.oontz.com